# Altium schematic sheet PG18_ BATT_ SPK _ Featu.SchDoc
size 420 x 297 mm
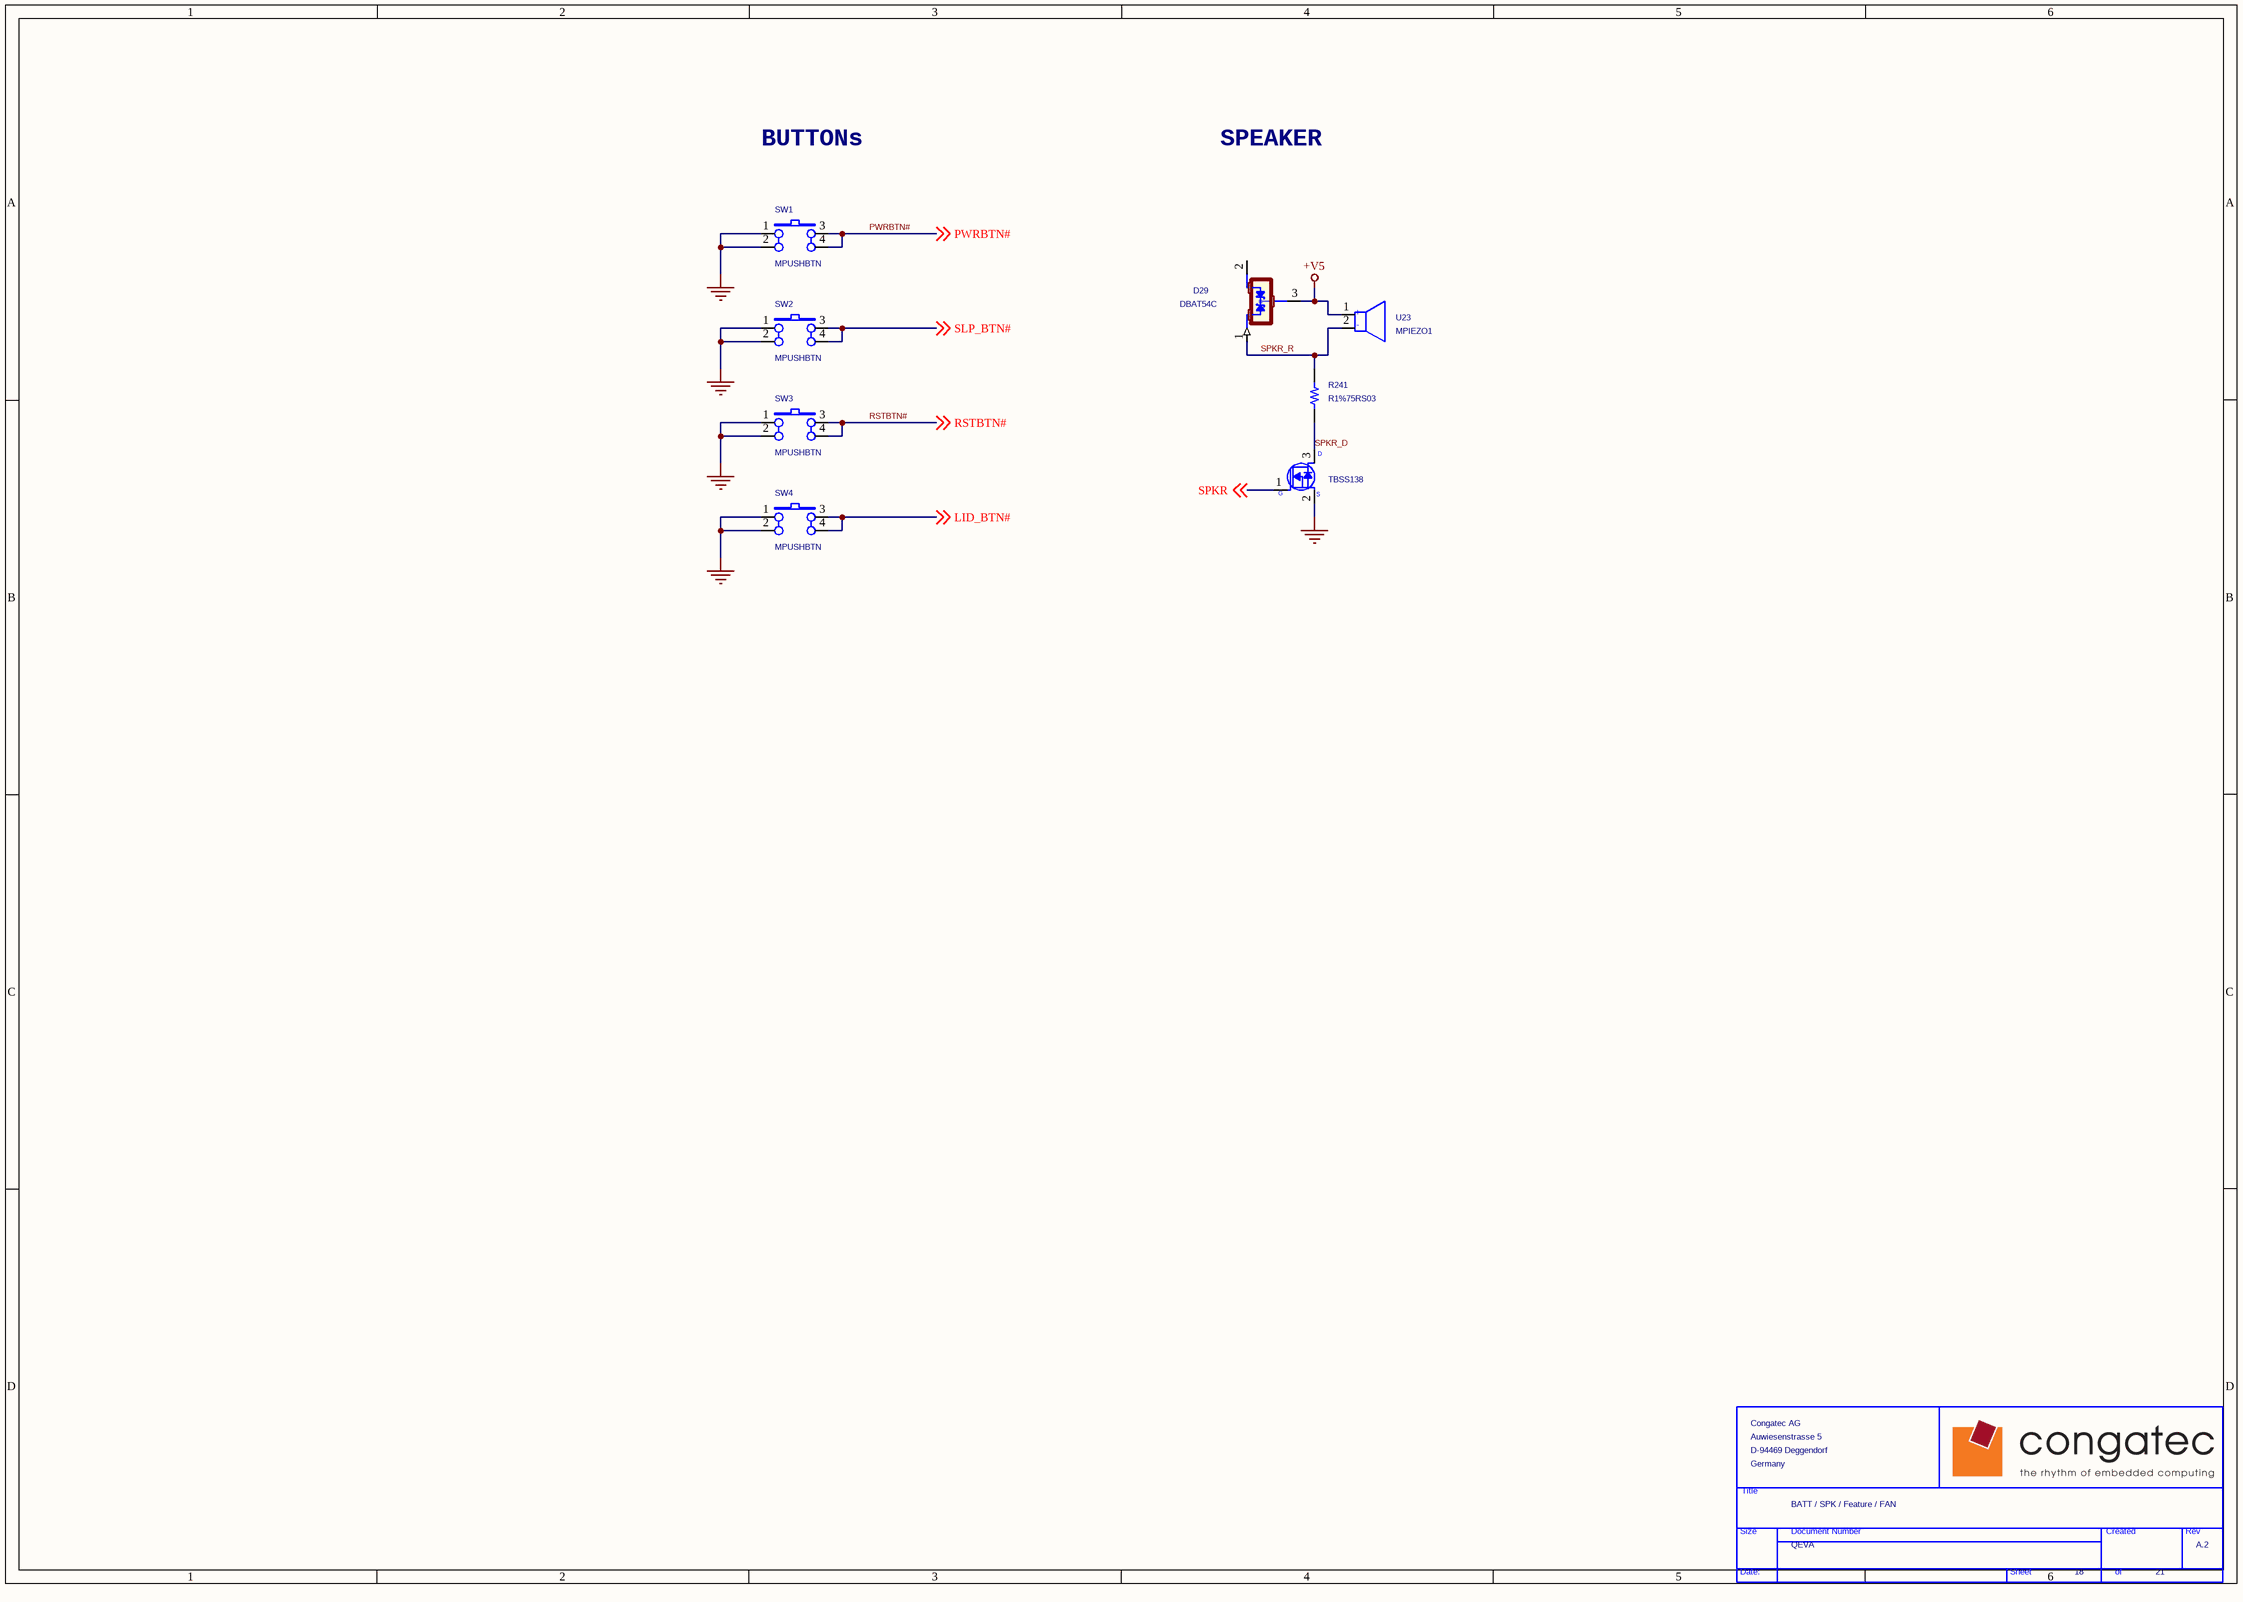
[diagram p0: PG18_ BATT_ SPK _ Featu.SchDoc]

## Parts
*  Page Count: 21  Page Number: 18  Title: BATT / SPK / Feature / FAN  RevCode: A.2  Doc: QEVA  OrgName: Congatec AG  OrgAddr1: Auwiesenstrasse 5  OrgAddr2: D-94469 Deggendorf  OrgAddr3: Germany  (hidden comment: TitleBlock_CONGA)  (graphical)
D29  DBAT54C  [SOT-23A]
Q19  TBSS138  [SOT-23A]
R241  R1%75RS03  [R0603]
SW1  MPUSHBTN  [SW_4P_193x193_H59]
SW2  MPUSHBTN  [SW_4P_193x193_H59]
SW3  MPUSHBTN  [SW_4P_193x193_H59]
SW4  MPUSHBTN  [SW_4P_193x193_H59]
U23  MPIEZO1  [BUZZER2D]

## Nets
+V5: D29.3(ANODE) U23.1
GND: Q19.2(S) SW1.1 SW1.2 SW2.1 SW2.2 SW3.1 SW3.2 SW4.1 SW4.2
LID_BTN#: SW4.3(PTH_1) SW4.4(PTH_2) ; off-sheet LID_BTN#
PWRBTN#: SW1.3(PTH_1) SW1.4(PTH_2) ; off-sheet PWRBTN#
RSTBTN#: SW3.3(PTH_1) SW3.4(PTH_2) ; off-sheet RSTBTN#
SLP_BTN#: SW2.3(PTH_1) SW2.4(PTH_2) ; off-sheet SLP_BTN#
SPKR: Q19.1(G) ; off-sheet SPKR
SPKR_D: Q19.3(D) R241.1
SPKR_R: D29.1(CATHODE_1) R241.2 U23.2

Not connected (* = marked no-connect by the designer): D29 2(CATHODE_2)

## Notes on the sheet
- BUTTONs
- SPEAKER
- (in symbol 175_BUZZER_2P_0) +; -
- (in symbol TitleBlock_CONGA) Title; Size; Document Number; Created; Rev; Date:; Sheet; of

## Library data of the parts
D29 = 130_Schottky_SOT-23A_CC_1: *DIODE Schottky BAT54C SMT SOT-23 3PIN; Part Number: 1300005440; Manufacture Part Number: BAT54 SMD T/R試BAT54C; Part_Number: 42500002; BOM_Level: 1; Package: SOT-23; ProcessType: SMT; Revision: A
Q19 = 131_SOT-23A_GSD_0: MOSFET MPN BSS138_NL SMD SOT-23 3P 50V N-channe; Part_Number: 44000026; Part Number: 1310000011; BOM_Level: 1; ProcessType: SMT; Revision: B; Manufacture Part Number: BSS138_NL; Package: SOT-23
R241 = 10_R_0_Dup1: R 75 1/10W 5% SMD 0603 CR WO/Pb; Part_Number: 45502007; Part Number: 105A707509; Manufacture Part Number: 23227026759L試2322 702 60759L試2322 702 60759L試0603WGJ0750T5E試RC0603JR-0775RL試RM06JTN750; BOM_Level: 1; ProcessType: SMT; Revision: A; Tolerance: 5%; Package: 0603
SW1-SW4 = 160_SW_STS-05-A_0: SMD TACTILE SWITCH 4P 4.9*4.9*1.5mmSTS-05-A; Part_Number: 47500025; Part Number: 1600000031; BOM_Level: 1; ProcessType: SMT; Revision: A; Manufacture Part Number: STS-05-A; Package: SW6PSMD
U23 = 175_BUZZER_2P_0: BUZZER 12*9.5mm,P-P=6.5mm L=3.0mm 40mA 5V 85dB; Part Number: 1759400002; Manufacture Part Number: BPL-SAT-1205HE3-LF試PAC-WT-1205-P; Part_Number: 48200001; ProcessType: DIP; BOM_Level: 1; Package: 12*9.5mm,P-P=6.5mm; Revision: A
* = TitleBlock_CONGA: Page Create Date: March  8, 1995